# EAGLE schematic DiffAmp (EAGLE 9.0.0)
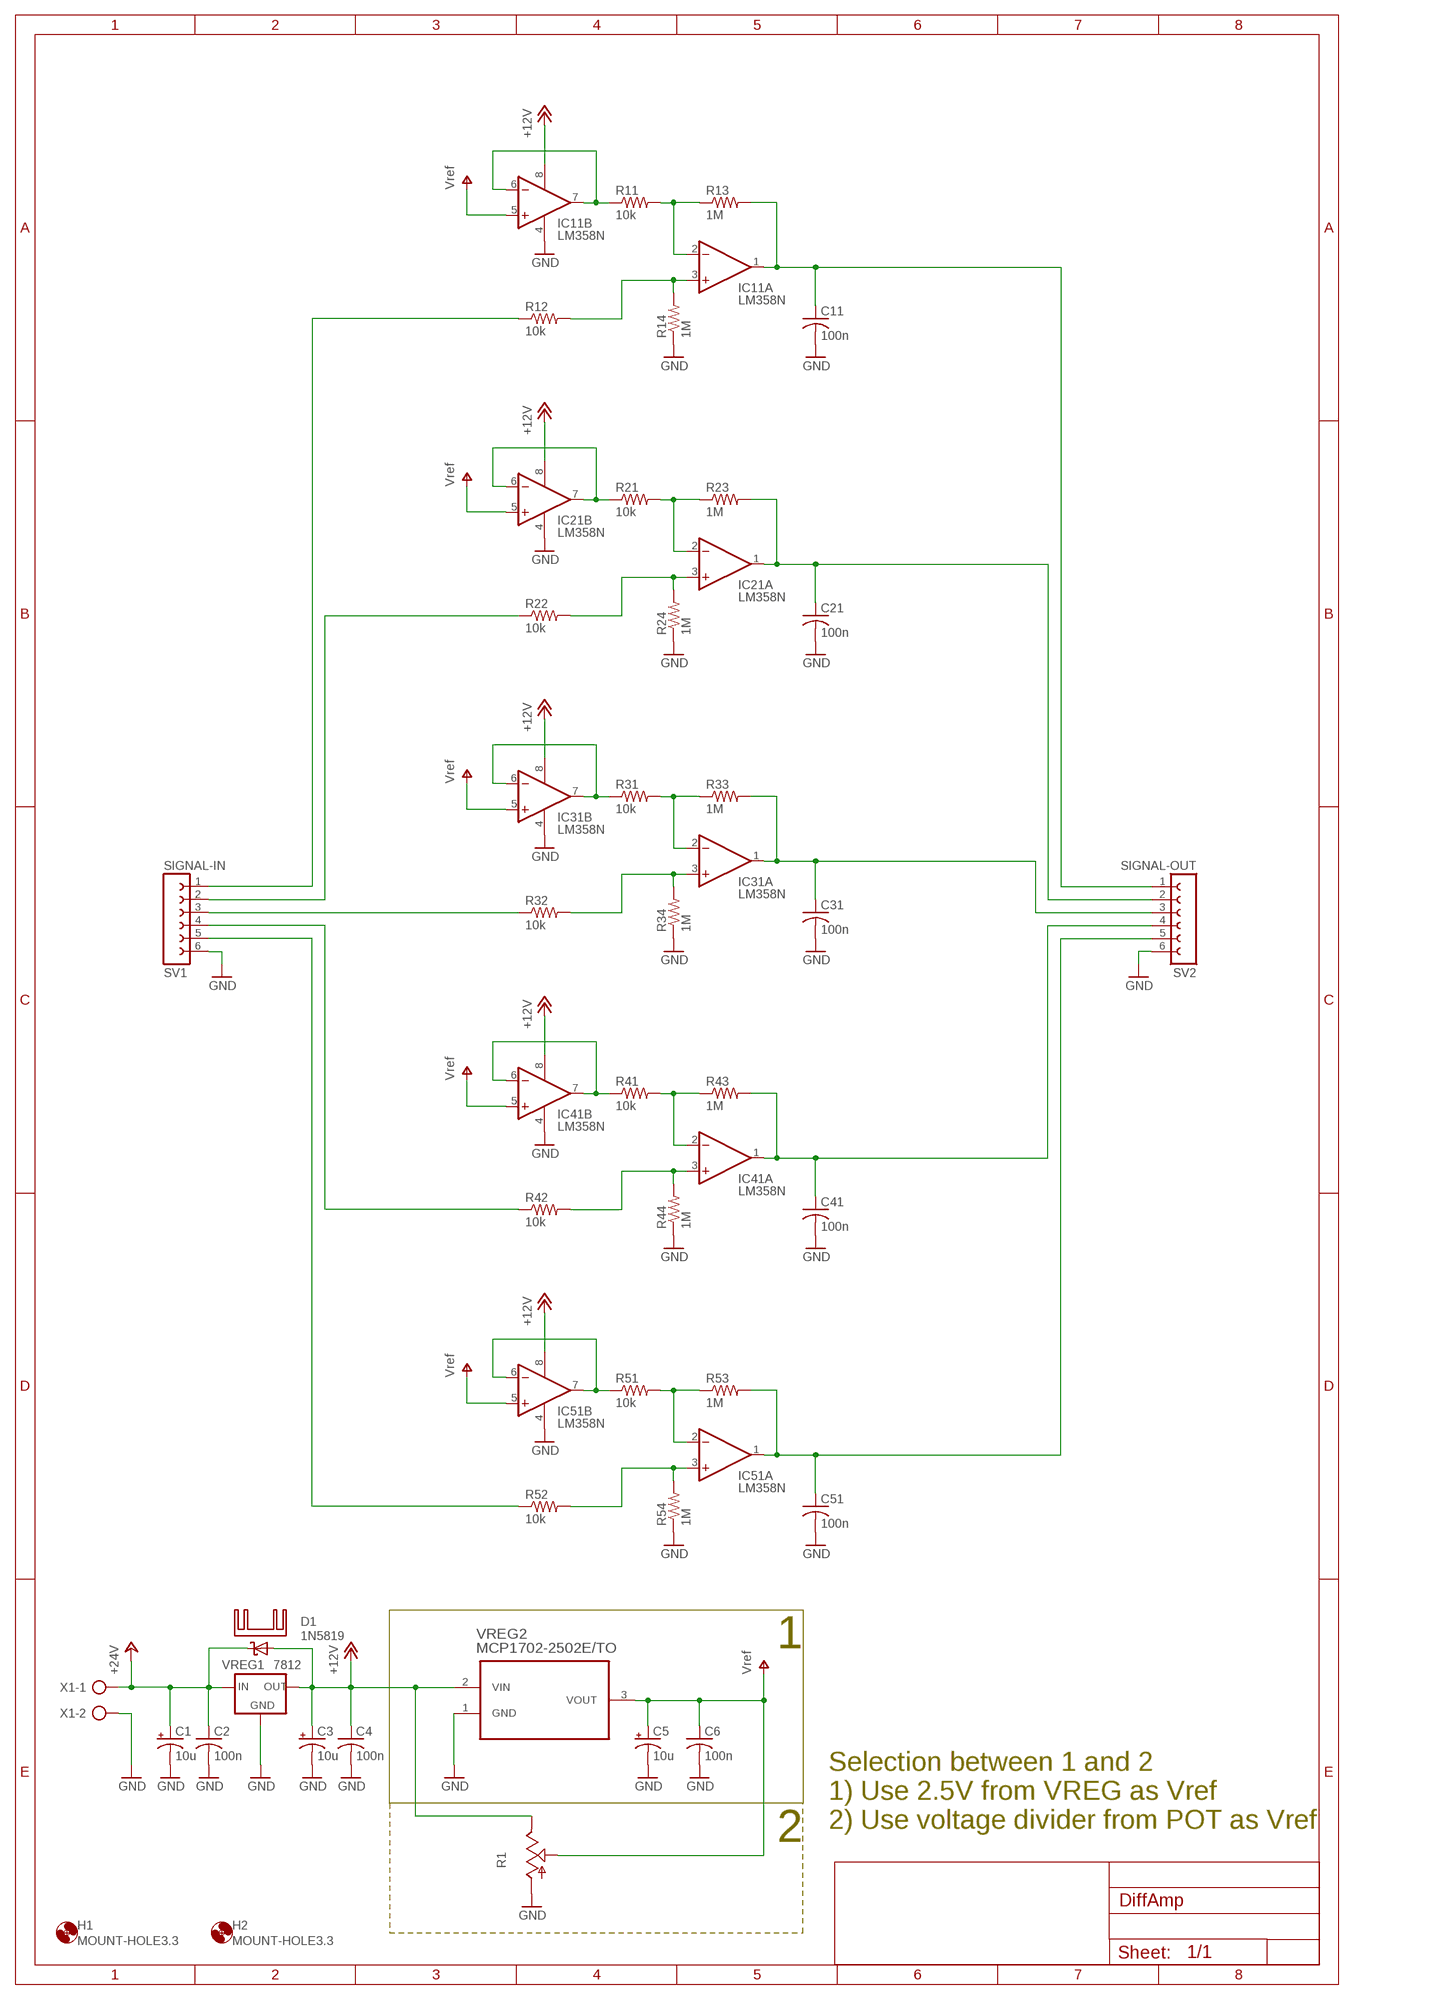
[diagram p0: schematic, sheet 1]

## Parts
C1  10u  CPOL-USE2-5  [E2-5]
C2  100n  C-US050-025X075  [C050-025X075]
C3  10u  CPOL-USE2-5  [E2-5]
C4  100n  C-US050-025X075  [C050-025X075]
C5  10u  CPOL-USE2-5  [E2-5]
C6  100n  C-US050-025X075  [C050-025X075]
C11  100n  C-US050-025X075  [C050-025X075]
C21  100n  C-US050-025X075  [C050-025X075]
C31  100n  C-US050-025X075  [C050-025X075]
C41  100n  C-US050-025X075  [C050-025X075]
C51  100n  C-US050-025X075  [C050-025X075]
D1  1N5819  SCHOTTKY-DIODEDO35-7  [DO35-7]
H1  MOUNT-HOLE3.3  [3,3]
H2  MOUNT-HOLE3.3  [3,3]
IC11  LM358N  [DIL08]
IC21  LM358N  [DIL08]
IC31  LM358N  [DIL08]
IC41  LM358N  [DIL08]
IC51  LM358N  [DIL08]
KK1  SK95-2M3  [SK95-2M3]
R1  TRIM_US-S64W  [S64W]
R11  10k  R-US_0207/7  [0207/7]
R12  10k  R-US_0207/7  [0207/7]
R13  1M  R-US_0207/7  [0207/7]
R14  1M  R-US_0207/7  [0207/7]
R21  10k  R-US_0207/7  [0207/7]
R22  10k  R-US_0207/7  [0207/7]
R23  1M  R-US_0207/7  [0207/7]
R24  1M  R-US_0207/7  [0207/7]
R31  10k  R-US_0207/7  [0207/7]
R32  10k  R-US_0207/7  [0207/7]
R33  1M  R-US_0207/7  [0207/7]
R34  1M  R-US_0207/7  [0207/7]
R41  10k  R-US_0207/7  [0207/7]
R42  10k  R-US_0207/7  [0207/7]
R43  1M  R-US_0207/7  [0207/7]
R44  1M  R-US_0207/7  [0207/7]
R51  10k  R-US_0207/7  [0207/7]
R52  10k  R-US_0207/7  [0207/7]
R53  1M  R-US_0207/7  [0207/7]
R54  1M  R-US_0207/7  [0207/7]
SV1  SIGNAL-IN  FE06-1  [FE06]
SV2  SIGNAL-OUT  FE06-1  [FE06]
VREG1  7812  78XXS  [78XXS]
VREG2  MCP1702-2502E/TO  MCP1702-3302E/TO  [TO127P254X533-3]
X1  AK500/2  [AK500/2]

## Nets
+12V: C3.+ C4.1 D1.A IC11.8(P:V+) IC21.8(P:V+) IC31.8(P:V+) IC41.8(P:V+) IC51.8(P:V+) R1.E VREG1.OUT VREG2.2(VIN)
+24V: C1.+ C2.1 D1.C VREG1.IN X1.1
GND: C1.- C2.2 C3.- C4.2 C5.- C6.2 C11.2 C21.2 C31.2 C41.2 C51.2 IC11.4(P:V-) IC21.4(P:V-) IC31.4(P:V-) IC41.4(P:V-) IC51.4(P:V-) R1.A R14.1 R24.1 R34.1 R44.1 R54.1 SV1.6 SV2.6 VREG1.GND VREG2.1(GND) X1.2
N$1: C11.1 IC11.1(A:OUT) R13.2 SV2.1
N$2: IC11.3(A:+IN) R12.2 R14.2
N$3: IC11.2(A:-IN) R11.2 R13.1
N$4: R12.1 SV1.1
N$5: IC11.6(B:-IN) IC11.7(B:OUT) R11.1
N$6: C31.1 IC31.1(A:OUT) R33.2 SV2.3
N$7: IC31.3(A:+IN) R32.2 R34.2
N$8: C21.1 IC21.1(A:OUT) R23.2 SV2.2
N$9: IC21.3(A:+IN) R22.2 R24.2
N$10: IC21.2(A:-IN) R21.2 R23.1
N$11: R22.1 SV1.2
N$12: IC21.6(B:-IN) IC21.7(B:OUT) R21.1
N$13: IC31.2(A:-IN) R31.2 R33.1
N$14: R32.1 SV1.3
N$15: IC31.6(B:-IN) IC31.7(B:OUT) R31.1
N$16: C41.1 IC41.1(A:OUT) R43.2 SV2.4
N$17: IC41.3(A:+IN) R42.2 R44.2
N$18: IC41.2(A:-IN) R41.2 R43.1
N$19: R42.1 SV1.4
N$20: IC41.6(B:-IN) IC41.7(B:OUT) R41.1
N$21: C51.1 IC51.1(A:OUT) R53.2 SV2.5
N$22: IC51.3(A:+IN) R52.2 R54.2
N$23: IC51.2(A:-IN) R51.2 R53.1
N$24: R52.1 SV1.5
N$25: IC51.6(B:-IN) IC51.7(B:OUT) R51.1
V+: C5.+ C6.1 IC11.5(B:+IN) IC21.5(B:+IN) IC31.5(B:+IN) IC41.5(B:+IN) IC51.5(B:+IN) R1.S VREG2.3(VOUT) ; supply symbol labelled Vref

## Notes on the sheet
- 1
- Selection between 1 and 2
  1) Use 2.5V from VREG as Vref
  2) Use voltage divider from POT as Vref
- 2

## Library data of the parts
C1 C3 C5 = rcl:CPOL-US: POLARIZED CAPACITOR, American symbol
C2 C4 C6 C11 C21 C31 C41 C51 = rcl:C-US: CAPACITOR, American symbol
D1 = diode:SCHOTTKY-DIODE: Schottky Diode
H1 H2 = holes:MOUNT-HOLE: MOUNTING HOLE with drill center marker
IC11 IC21 IC31 IC41 IC51 = linear:LM358: OP AMP also LM158; LM258; LM2904 Source: http://cache.national.com/ds/LM/LM158.pdf
KK1 = heatsink:SK95-2M3: HEATSINK manufacturer Fischer/distributor Buerklin
R1 = pot:TRIM_US-: POTENTIOMETER
R11-R14 R21-R24 R31-R34 R41-R44 R51-R54 = rcl:R-US_: RESISTOR, American symbol
SV1 SV2 = con-lsta:FE06-1: FEMALE HEADER; OC_FARNELL: unknown; OC_NEWARK: unknown
VREG1 = v-reg:78XXS: VOLTAGE REGULATOR
VREG2 = DiffAmp:MCP1702-3302E/TO: IC, V REG, LDO, 250MA; MPN: MCP1702-3302E/TO; OC_FARNELL: 1331485; OC_NEWARK: 34M7419; PACKAGE: TO-92; SUPPLIER: Microchip
X1 = con-ptr500:AK500/2: CONNECTOR; OC_FARNELL: unknown; OC_NEWARK: unknown